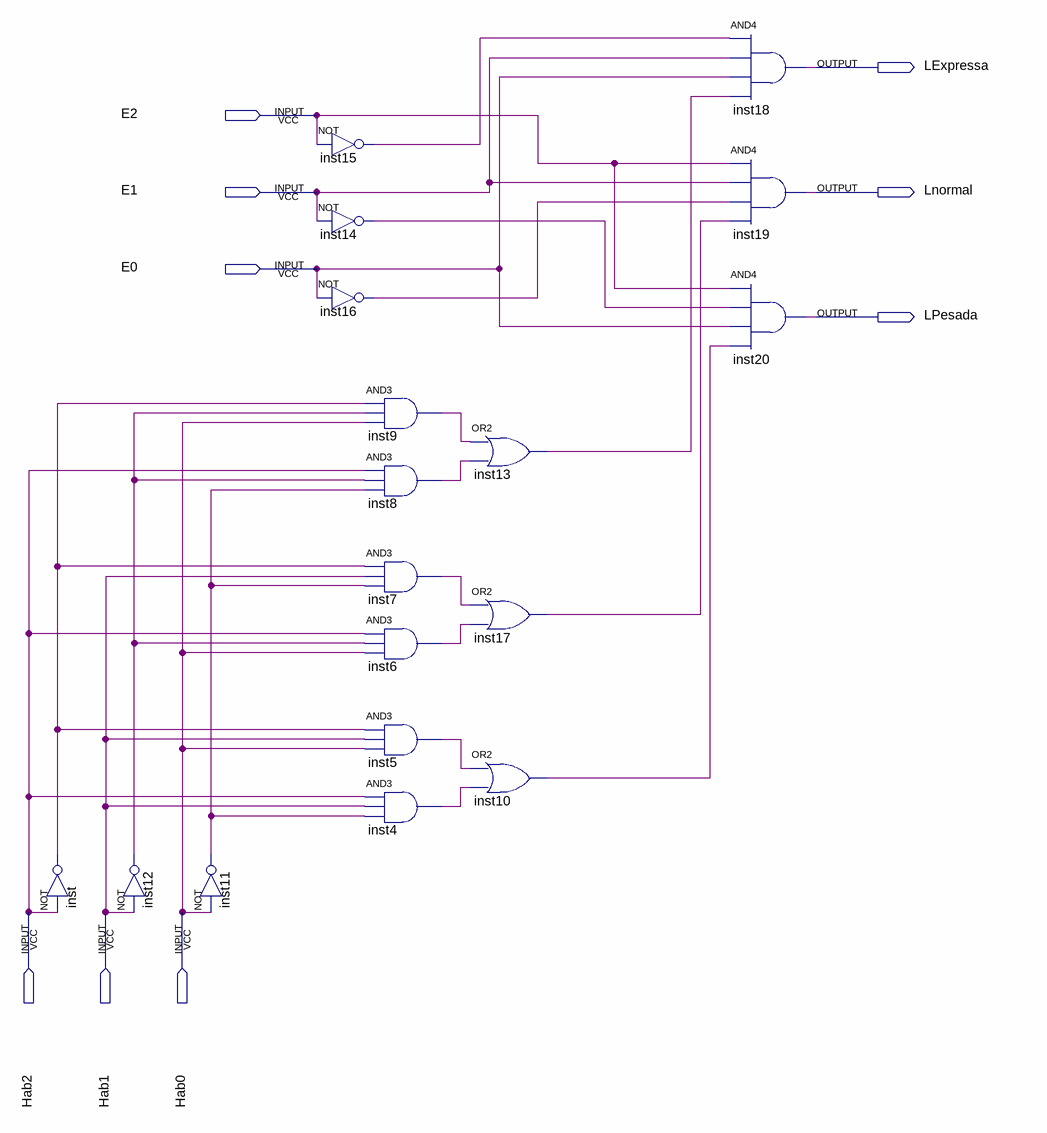
[diagram p0: schematic sheet]
// Quartus schematic IndicadoresFimDeLavagem.bdf as structural Verilog: 18 symbols, 9 pins
module IndicadoresFimDeLavagem (
  input  E2,
  input  E1,
  input  E0,
  input  Hab2,
  input  Hab1,
  input  Hab0,
  output LExpressa,
  output Lnormal,
  output LPesada
);

  wire inst4_out, inst5_out, inst6_out, inst7_out, inst8_out, inst9_out, inst10_out, inst11_out, inst12_out,
       inst13_out, inst14_out, inst15_out, inst16_out, inst17_out, inst_out;

  not inst (inst_out, Hab2);
  not inst12 (inst12_out, Hab1);
  not inst11 (inst11_out, Hab0);
  not inst15 (inst15_out, E2);
  not inst14 (inst14_out, E1);
  not inst16 (inst16_out, E0);
  and inst9 (inst9_out, inst_out, inst12_out, Hab0);
  and inst8 (inst8_out, Hab2, inst12_out, inst11_out);
  and inst7 (inst7_out, inst_out, Hab1, inst11_out);
  and inst6 (inst6_out, Hab2, inst12_out, Hab0);
  and inst5 (inst5_out, inst_out, Hab1, Hab0);
  and inst4 (inst4_out, Hab2, Hab1, inst11_out);
  or inst13 (inst13_out, inst9_out, inst8_out);
  or inst17 (inst17_out, inst7_out, inst6_out);
  or inst10 (inst10_out, inst5_out, inst4_out);
  and inst18 (LExpressa, inst15_out, E1, E0, inst13_out);
  and inst19 (Lnormal, E2, E1, inst16_out, inst17_out);
  and inst20 (LPesada, E2, inst14_out, E0, inst10_out);
endmodule
